# EAGLE design arduino_usb_v22 (EAGLE 5.10)
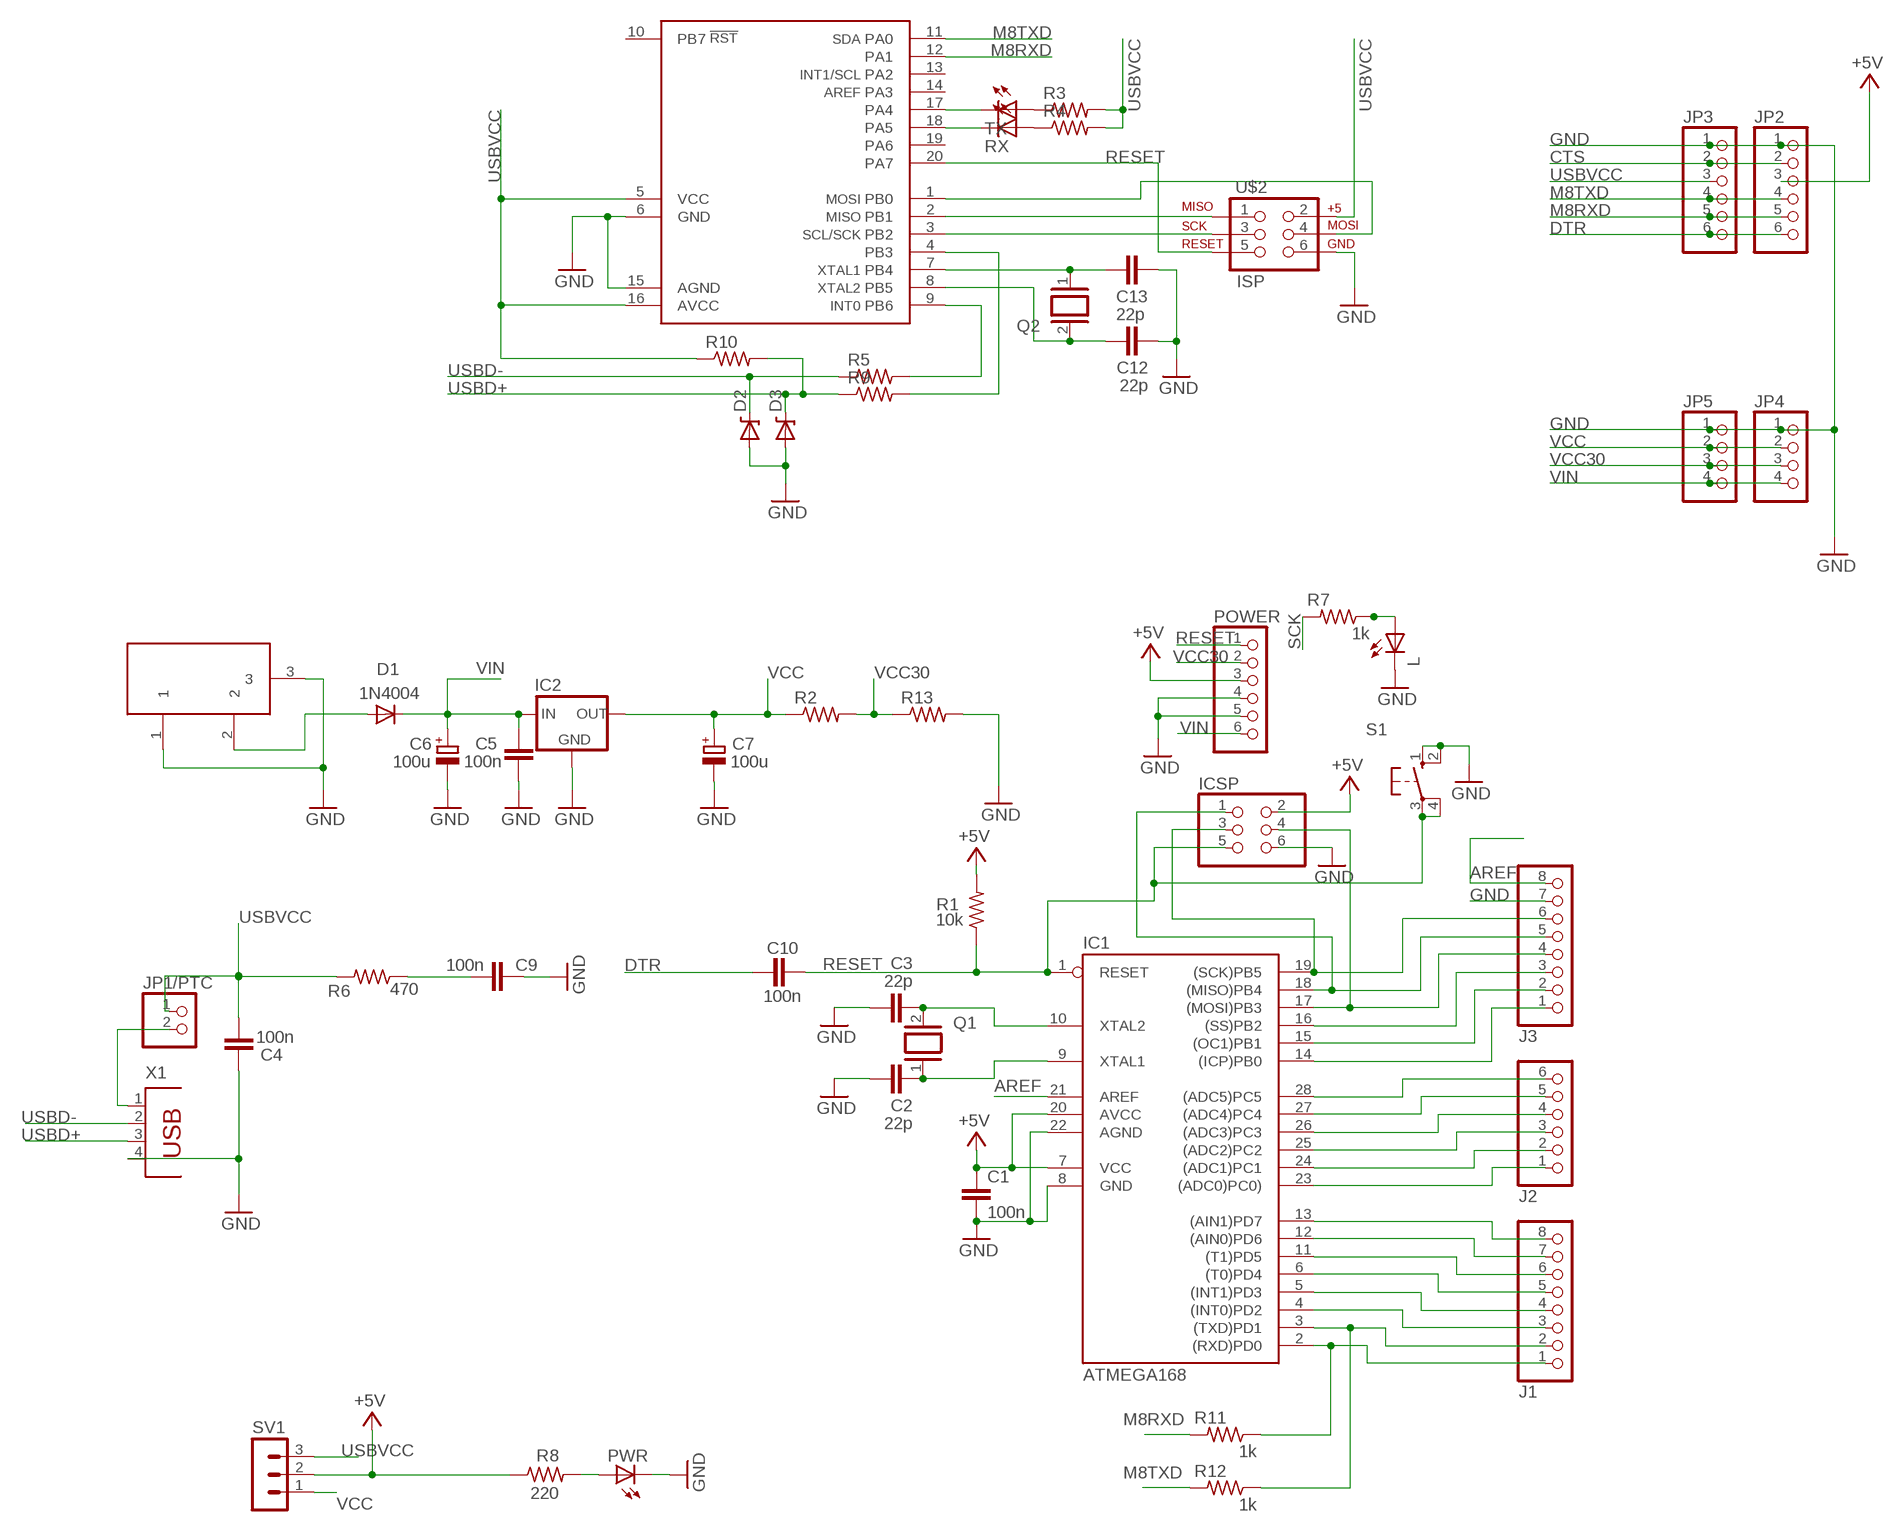
[diagram p0: schematic, sheet 1]

## Parts
C1  100n  C-EU050-025X075  [C050-025X075]
C2  22p  C-EU050-025X075  [C050-025X075]
C3  22p  C-EU050-025X075  [C050-025X075]
C4  100n  C-EU050-025X075  [C050-025X075]
C5  100n  C-EU050-025X075  [C050-025X075]
C6  100u  CPOL-EUE3.5-8  [E3,5-8]
C7  100u  CPOL-EUE3.5-8  [E3,5-8]
C9  100n  C-EU050-025X075  [C050-025X075]
C10  100n  C-EU050-025X075  [C050-025X075]
C12  22p  C-EU050-025X075  [C050-025X075]
C13  22p  C-EU050-025X075  [C050-025X075]
D1  1N4004  [DO41-10]
D2  DIODE-ZENERSMB  [SMB-DIODE]
D3  DIODE-ZENERSMB  [SMB-DIODE]
DC1  DC21MMX  [DC-21MM]
IC1  ATMEGA168  AT90S4433P  [DIL28-3]
IC2  78MXXS  [78MXXS]
ICSP  PINHD-2X3  [2X03]
J1  PINHD-1X8  [1X08]
J2  PINHD-1X6  [1X06]
J3  PINHD-1X8  [1X08]
JP1/PTC  PINHD-1X2  [1X02]
JP2  PINHD-1X6  [1X06]
JP3  PINHD-1X6  [1X06]
JP4  PINHD-1X4  [1X04]
JP5  PINHD-1X4  [1X04]
L  LED3MM  [LED3MM]
POWER  PINHD-1X6  [1X06]
PWR  LED3MM  [LED3MM]
Q1  XTAL/S  [QS]
Q2  XTAL/S  [QS]
R1  10k  R-US_0207/10  [0207/10]
R2  R-US_0207/10  [0207/10]
R3  R-US_0207/10  [0207/10]
R4  R-US_0207/10  [0207/10]
R5  R-US_0207/10  [0207/10]
R6  470  R-US_0207/10  [0207/10]
R7  1k  R-US_0207/10  [0207/10]
R8  220  R-US_0207/10  [0207/10]
R9  R-US_0207/10  [0207/10]
R10  R-US_0207/10  [0207/10]
R11  1k  R-US_0207/10  [0207/10]
R12  1k  R-US_0207/10  [0207/10]
R13  R-US_0207/10  [0207/10]
RX  LED3MM  [LED3MM]
S1  10-XX  [B3F-10XX]
SV1  MA03-1  [MA03-1]
TX  LED3MM  [LED3MM]
U$1  ATTINY61-PDIP  [DIL20]
U$2  ISP  AVR_SPI_PRG_6NS  [2X3-NS]
X1  PN61729  [PN61729]

## Nets
+5V [power]: C1.1 IC1.7(VCC) IC1.20(AVCC) ICSP.2 JP2.3 POWER.3 R1.2 R8.1 SV1.2
AREF: IC1.21(AREF) J3.8
CTS: JP2.2 JP3.2
DTR: C10.1 JP2.6 JP3.6
GND [power]: C1.2 C2.1 C3.1 C4.2 C5.1 C6.- C7.- C9.2 C12.2 C13.1 D2.A D3.A DC1.1 DC1.3 IC1.8(GND) IC1.22(AGND) IC2.GND ICSP.6 J3.7 JP2.1 JP3.1 JP4.1 JP5.1 L.K(C) POWER.4 POWER.5 PWR.K(C) R13.2 S1.1(S) S1.2(S1) U$1.6(GND) U$1.15(AGND) U$2.6 X1.4
M8RXD: JP2.5 JP3.5 R11.2 U$1.12(PA1)
M8TXD: JP2.4 JP3.4 R12.2 U$1.11(PA0)
N$1: IC1.18((MISO)PB4) ICSP.1 J3.5
N$2: L.A R7.1
N$3: PWR.A R8.2
N$4: IC1.17((MOSI)PB3) ICSP.4 J3.4
N$5: IC1.14((ICP)PB0) J3.1
N$6: C2.2 IC1.9(XTAL1) Q1.1
N$7: C3.2 IC1.10(XTAL2) Q1.2
N$8 [power]: D1.A DC1.2
N$10: IC1.4((INT0)PD2) J1.3
N$11: IC1.5((INT1)PD3) J1.4
N$12: IC1.6((T0)PD4) J1.5
N$13: IC1.11((T1)PD5) J1.6
N$14: IC1.12((AIN0)PD6) J1.7
N$15: IC1.13((AIN1)PD7) J1.8
N$16: IC1.23((ADC0)PC0)) J2.1
N$17: IC1.24((ADC1)PC1) J2.2
N$18: IC1.25((ADC2)PC2) J2.3
N$19: IC1.26((ADC3)PC3) J2.4
N$20: IC1.27((ADC4)PC4) J2.5
N$21: IC1.28((ADC5)PC5) J2.6
N$22: IC1.15((OC1)PB1) J3.2
N$23: IC1.16((SS)PB2) J3.3
N$25: R3.1 TX.A
N$26: R4.1 RX.A
N$30: C9.1 R6.1
N$34 [power]: JP1/PTC.2 X1.1
N$40: C12.1 Q2.2 U$1.8(PB5)
N$41: C13.2 Q2.1 U$1.7(PB4)
N$43: U$1.1(PB0) U$2.4
N$46: U$1.2(PB1) U$2.1
N$47: U$1.3(PB2) U$2.3
N$53: TX.K(C) U$1.17(PA4)
N$54: RX.K(C) U$1.18(PA5)
N$59: R5.2 U$1.9(PB6)
N$60: R9.2 U$1.4(PB3)
RESET: C10.2 IC1.1(RESET) ICSP.5 POWER.1 R1.1 S1.3(P) S1.4(P1) U$1.20(PA7) U$2.5
RXD: IC1.2((RXD)PD0) J1.1 R11.1
SCK: IC1.19((SCK)PB5) ICSP.3 J3.6 R7.2
TXD: IC1.3((TXD)PD1) J1.2 R12.1
USBD+: D3.C R9.1 R10.2 X1.3
USBD-: D2.C R5.1 X1.2
USBVCC [power]: C4.1 JP1/PTC.1 JP3.3 R3.2 R4.2 R6.2 R10.1 SV1.3 U$1.5(VCC) U$1.16(AVCC) U$2.2
VCC [power]: C7.+ IC2.OUT JP4.2 JP5.2 R2.1 SV1.1
VCC30: JP4.3 JP5.3 POWER.2 R2.2 R13.1
VIN [power]: C5.2 C6.+ D1.C IC2.IN JP4.4 JP5.4 POWER.6
Unconnected: U$1.10(PB7) U$1.13(PA2) U$1.14(PA3) U$1.19(PA6)

## Library data of the parts
C1-C5 C9 C10 C12 C13 = rcl:C-EU: CAPACITOR, European symbol
C6 C7 = rcl:CPOL-EU: POLARIZED CAPACITOR, European symbol
D1 = diode:1N4004: DIODE general purpose rectifier, 1 A
D2 D3 = SparkFun:DIODE-ZENER
DC1 = powersupply:DC21MM
IC1 = atmel:AT90S4433: MICROCONTROLLER 4 Kbytes FLASH 128 bytes SRAM 256 bytes EEPROM UART 6-channel 10 bit ADC
IC2 = v-reg:78MXXS: VOLTAGE REGULATOR
ICSP = pinhead:PINHD-2X3: PIN HEADER
J1 J3 = pinhead:PINHD-1X8: PIN HEADER
J2 JP2 JP3 POWER = pinhead:PINHD-1X6: PIN HEADER
JP1/PTC = pinhead:PINHD-1X2: PIN HEADER
JP4 JP5 = pinhead:PINHD-1X4: PIN HEADER
L PWR RX TX = led:LED: LED OSRAM: - CHIPLED LG R971, LG N971, LY N971, LG Q971, LY Q971, LO R971, LY R971 LH N974, LH R974 LS Q976, LO Q976, LY Q976 LO Q996 - Hyper CHIPLED LW Q18S LB Q993, LB Q99A, LB R99A - SideLED LS A670, LO A670, LY A670, LG A670, LP A670 LB A673, LV A673, LT A673, LW A673 LH A674 LY A675 LS A676, LA A676, LO A676, LY A676, LW A676 LS A679, LY A679, LG A679 - Hyper Micro SIDELED® LS Y876, LA Y876, LO Y876, LY Y876 LT Y87S - SmartLED LW L88C, LW L88S LB L89C, LB L89S, LG L890 LS L89K, LO L89K, LY L89K LS L896, LA L896, LO L896, LY L896 - TOPLED LS T670, LO T670, LY T670, LG T670, LP T670 LSG T670, LSP T670, LSY T670, LOP T670, LYG T670 LG T671, LOG T671, LSG T671 LB T673, LV T673, LT T673, LW T673 LH T674 LS T676, LA T676, LO T676, LY T676, LB T676, LH T676, LSB T676, LW T676 LB T67C, LV T67C, LT T67C, LS T67K, LO T67K, LY T67K, LW E67C LS E67B, LA E67B, LO E67B, LY E67B, LB E67C, LV E67C, LT E67C LW T67C LS T679, LY T679, LG T679 LS T770, LO T770, LY T770, LG T770, LP T770 LB T773, LV T773, LT T773, LW T773 LH T774 LS E675, LA E675, LY E675, LS T675 LS T776, LA T776, LO T776, LY T776, LB T776 LHGB T686 LT T68C, LB T68C - Hyper Mini TOPLED® LB M676 - Mini TOPLED Santana® LG M470 LS M47K, LO M47K, LY M47K Source: http://www.osram.convergy.de/
Q1 Q2 = special:XTAL/S: CRYSTAL
R1-R13 = resistor:R-US_: RESISTOR, American symbol
S1 = switch-omron:10-XX: OMRON SWITCH
SV1 = con-lstb:MA03-1: PIN HEADER
U$1 = SparkFun:ATTINY*61-PDIP
U$2 = SparkFun:AVR_SPI_PRG_6: AVR ISP 6 Pin This is the reduced ISP connector for AVR programming. Common on Arduino. This footprint will take up less PCB space and can be used with a 10-pin to 6-pin adapter such as SKU: BOB-08508
X1 = con-berg:PN61729: BERG USB connector

## Net classes
1 power: width 0.406 mm

## Board
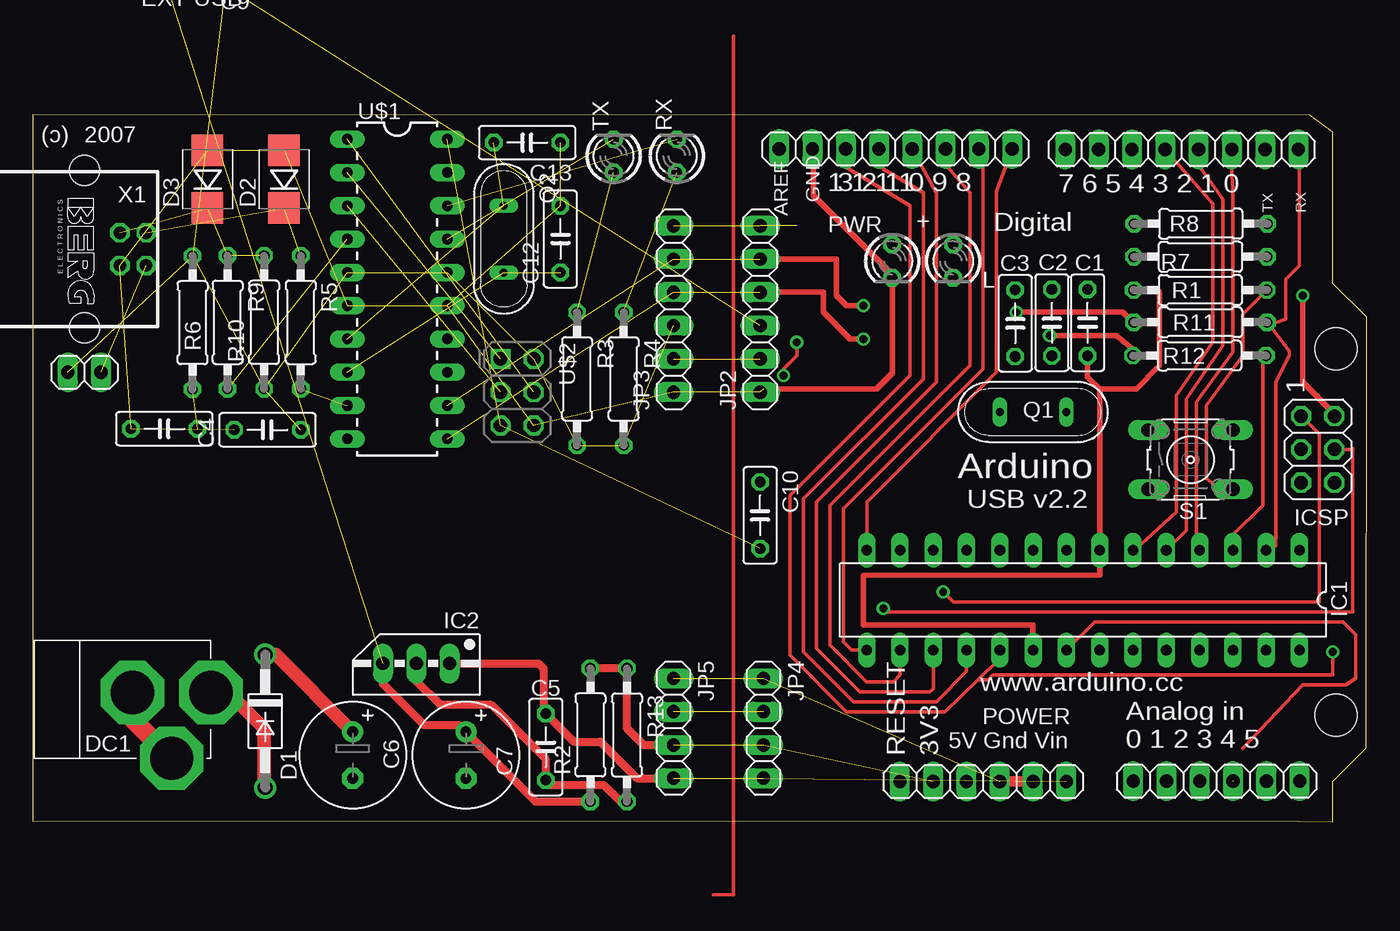
[diagram p1: board, top side]
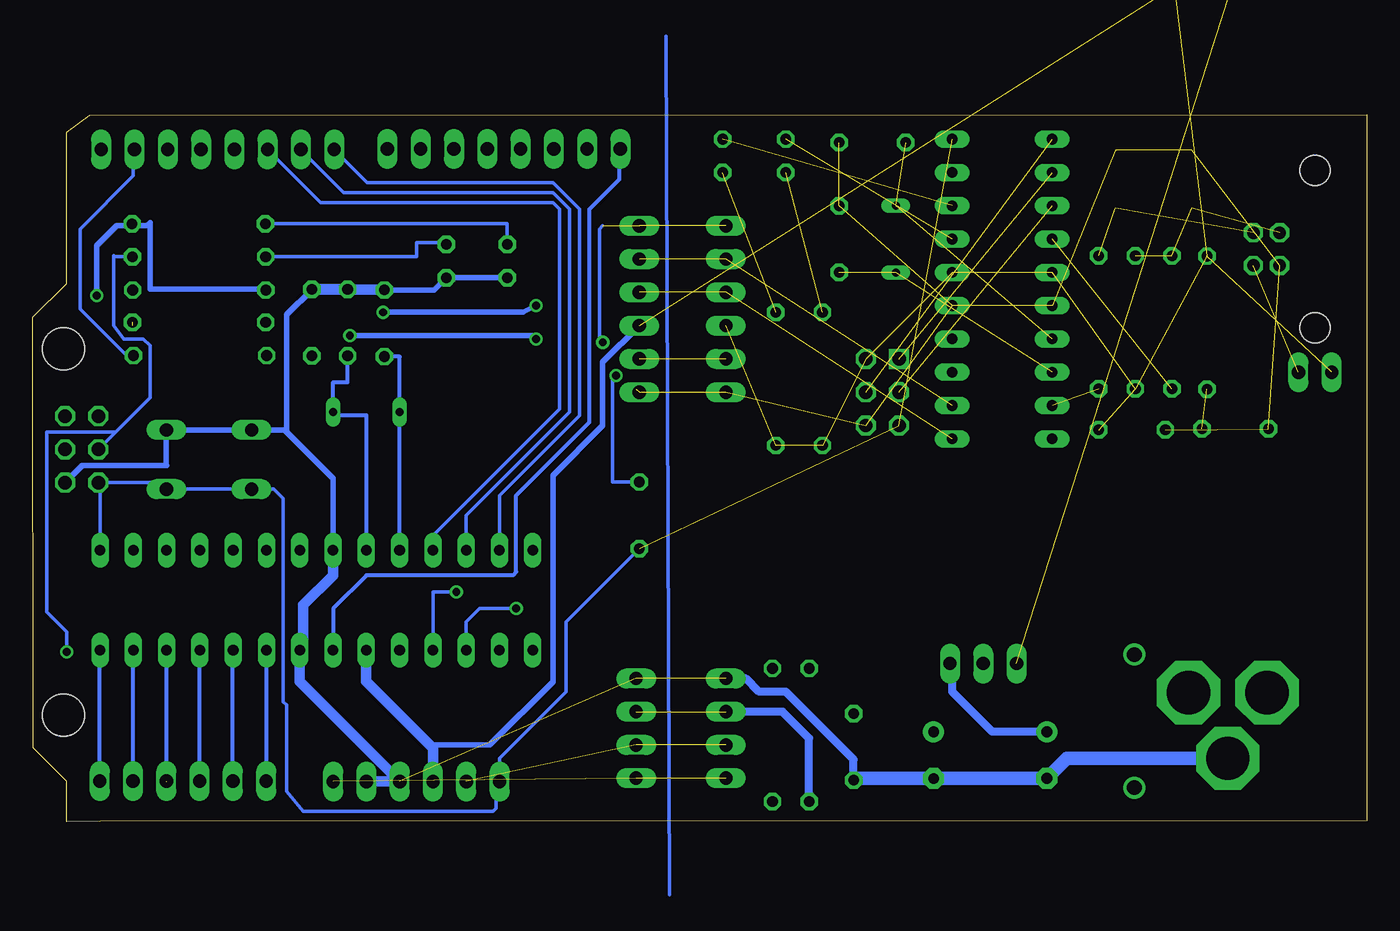
[diagram p2: board, bottom side, seen from below]

Size 101.79 x 53.95 mm. Coordinates in mm from the lower left corner, seen from the top.
Outline: 0,53.95 0,0.05 96.65,0.01 99.21,0 99.2,0.05 99.19,3.06 101.77,5.61 101.79,38.51 99.19,41.05 99.19,52.6 97.46,53.91 0,53.95
Copper layers (1*16): Top 0.035mm / dielectric 1.5mm / Bottom 0.035mm
Design rules "default *": minimum track width 10mil, minimum drill 10mil, track to track 10mil, track to pad 10mil, pad to pad 10mil, via to via 10mil, smd to smd 8mil, copper to edge 20mil, drill to drill 8mil, minimum pad ring 10mil, minimum via ring 8mil, stop-mask expansion 4mil, vias tented up to drill 0mil, thermal gap 10mil
Holes 3.2 mm at 99.44,36.08 99.44,8.14

### Footprints (pad centres in the part's own frame; a part is rotated, then mirrored left to right if it is on the bottom)
C050-025X075 = drill 0.813 octagon: 1 -2.54,0; 2 2.54,0
E3,5-8 = drill 0.813 pad 1.6 round: + -1.778,0 | drill 0.813 pad 1.6 octagon: - 1.778,0
DO41-10 = drill 1.118 round: A 5.08,0; C -5.08,0
SMB-DIODE = smd 2.4 x 2.4: A 2.2,0; C -2.2,0
DC-21MM = drill 3.302 pad 4.826 octagon: 1 -5.08,-3.353; 2 -0.076,-6.35; 3 -0.076,-0.356
DIL28-3 = drill 0.813 long: 1 -16.51,-3.81; 2 -13.97,-3.81; 3 -11.43,-3.81; 4 -8.89,-3.81; 5 -6.35,-3.81; 6 -3.81,-3.81; 7 -1.27,-3.81; 8 1.27,-3.81; 9 3.81,-3.81; 10 6.35,-3.81; 11 8.89,-3.81; 12 11.43,-3.81; 13 13.97,-3.81; 14 16.51,-3.81; 15 16.51,3.81; 16 13.97,3.81; 17 11.43,3.81; 18 8.89,3.81; 19 6.35,3.81; 20 3.81,3.81; 21 1.27,3.81; 22 -1.27,3.81; 23 -3.81,3.81; 24 -6.35,3.81; 25 -8.89,3.81; 26 -11.43,3.81; 27 -13.97,3.81; 28 -16.51,3.81
78MXXS = drill 1.016 long: GND 0,-2.54; IN -2.54,-2.54; OUT 2.54,-2.54
2X03 = drill 1.016 octagon: 1 -2.54,-1.27; 2 -2.54,1.27; 3 0,-1.27; 4 0,1.27; 5 2.54,-1.27; 6 2.54,1.27
1X08 = drill 1.016 long: 1 -8.89,0; 2 -6.35,0; 3 -3.81,0; 4 -1.27,0; 5 1.27,0; 6 3.81,0; 7 6.35,0; 8 8.89,0
1X06 = drill 1.016 long: 1 -6.35,0; 2 -3.81,0; 3 -1.27,0; 4 1.27,0; 5 3.81,0; 6 6.35,0
1X02 = drill 1.016 long: 1 -1.27,0; 2 1.27,0
1X04 = drill 1.016 long: 1 -3.81,0; 2 -1.27,0; 3 1.27,0; 4 3.81,0
LED3MM = drill 0.813 octagon: A -1.27,0; K 1.27,0
QS = drill 0.61 long: 1 -2.54,0; 2 2.54,0
0207/10 = drill 0.813 octagon: 1 -5.08,0; 2 5.08,0
B3F-10XX = drill 1.016 long: 1 -3.251,2.261; 2 3.251,2.261; 3 -3.251,-2.261; 4 3.251,-2.261
MA03-1 = drill 1.016 long: 1 -2.54,0; 2 0,0; 3 2.54,0
DIL20 = drill 0.813 long: 1 1.27,-7.62; 2 3.81,-7.62; 3 6.35,-7.62; 4 8.89,-7.62; 5 11.43,-7.62; 6 13.97,-7.62; 7 16.51,-7.62; 8 19.05,-7.62; 9 21.59,-7.62; 10 24.13,-7.62; 11 24.13,0; 12 21.59,0; 13 19.05,0; 14 16.51,0; 15 13.97,0; 16 11.43,0; 17 8.89,0; 18 6.35,0; 19 3.81,0; 20 1.27,0
2X3-NS = drill 1.016 square: 1 -2.54,-1.27 | drill 1.016 octagon: 2 -2.54,1.27; 3 0,-1.27; 4 0,1.27; 5 2.54,-1.27; 6 2.54,1.27
PN61729 = drill 0.95 octagon: 1 1.25,4.71; 2 -1.25,4.71; 3 -1.25,2.71; 4 1.25,2.71 | hole 2.3: -6.02,0; 6.02,0

### Placement (x,y rotation side)
C1  80.49,38.08 90 top
C2  77.77,38.09 270 top
C3  74.97,38.04 270 top
C4  17.91,29.91 180 top
C5  39.16,5.7 90 top
C6  24.41,5.08 270 top
C7  33.05,5.07 270 top
C9  10.04,29.98 180 top
C10  55.5,23.38 270 top
C12  40.26,44.46 90 top
C13  37.72,51.83 180 top
D1  17.73,7.67 270 top
D2  19.18,49.03 90 top
D3  13.34,49.03 90 top
DC1  7.24,9.92 90 top
IC1  80.15,16.91 180 top
IC2  29.26,9.54 180 top
ICSP  98.06,28.41 270 top
J1  87.69,51.3 180 top
J2  90.33,3.09 0 top
J3  65.84,51.34 180 top
JP1/PTC  3.94,34.3 0 top
JP2  55.5,39.13 90 top
JP3  48.9,39.13 90 top
JP4  55.76,7.12 270 top
JP5  48.9,7.12 270 top
L  70.23,42.78 270 top
POWER  72.52,3.06 0 top
PWR  65.59,42.78 270 top
Q1  76.33,31.26 180 top
Q2  35.94,44.46 270 top
R1  89.09,40.57 180 top
R2  42.55,6.61 90 top
R3  41.53,33.79 270 top
R4  45.09,33.79 270 top
R5  20.45,38.11 270 top
R6  12.2,38.09 90 top
R7  89.11,43.11 0 top
R8  89.13,45.63 180 top
R9  14.86,38.11 270 top
R10  17.66,38.11 90 top
R11  89.11,38.11 180 top
R12  89.03,35.57 180 top
R13  45.34,6.61 270 top
RX  49.15,50.81 90 top
S1  88.34,27.63 0 top
SV1  12.32,65.29 0 top  (outside the outline)
TX  44.33,50.81 90 top
U$1  31.63,53.35 270 top
U$2  36.96,32.78 270 top
X1  3.94,43.7 270 top

### Tracks (layer width: path | path; a pad name or v marks a point on that pad's centre or on a via)
+5V  (via drill 0.6)  (1 unrouted)
  Top 0.406: IC1.20 76.33,15 63.38,15 63.38,18.81 81.42,18.82 IC1.7 81.41,33.03 | 81.41,33.03 80.49,33.95 C1.1 | R1.2 84.01,40.46 84.2,40.65 85.73,40.65 85.98,40.4 85.98,34.81 84.2,33.03 81.41,33.03 | v96.9,40.14 96.9,33.54 99.33,31.11 ICSP.2
  Bottom 0.406: 94.36,45.48 R8.1 | 94.36,45.48 95.38,45.48 96.9,43.95 v96.9,40.14 | R1.2 84.09,40.65 92.84,40.65 92.84,45.73 93.09,45.48 94.36,45.48 | JP2.3 58.3,35.06 58.3,30.24 62.11,26.43 62.11,10.68 66.93,5.85 71.5,5.85
  Bottom 0.813: POWER.3 71.25,5.6 71.5,5.85 76.34,10.69 IC1.20
AREF
  Top 0.254: 92.33,5.6 96.9,10.42 100.21,10.42 100.97,10.93 100.97,14.23 99.95,15.25 81.03,15.25 IC1.21
  Bottom 0.305: IC1.21 78.87,16.27 76.33,18.81 65.15,18.81 64.9,19.06 64.9,24.9 59.31,30.49 59.31,46.75 57.03,49.03 57.03,51.27 J3.8
CTS  (1 unrouted)
DTR  (via drill 0.6)  (2 unrouted)
  Top 0.254: v57.28,34.05 57.28,34.55 58.3,35.57 v58.3,36.59
  Bottom 0.254: v57.28,34.05 57.53,33.79 57.53,25.92 C10.1 | v58.3,36.59 58.55,36.84 58.55,45.22 58.3,45.48
GND  (14 unrouted)
  Top 0.406: J3.7 59.57,51.27 59.57,47.76 65.59,41.74 PWR.K 65.59,34.22 64.39,33.03 55.76,33.03
  Top 0.61: R13.2 44.83,1.53 43.56,2.8 39.51,2.8 C5.1 39.16,4.75 35,8.9 31.12,8.9 29.26,10.75 IC2.GND
  Top 0.813: POWER.4 POWER.5
  Top 1.422: DC1.3 7.6,7.83 DC1.1
  Bottom 0.406: PWR.K L.K 71.17,40.57 C3.1 75.02,40.62 | C1.2 82.43,38.69 82.43,29.73 | 82.43,29.73 82.59,29.89 S1.1 S1.2 91.6,27.21 91.57,27.19 98.01,27.19 ICSP.6 | 82.43,29.73 78.88,26.18 IC1.8 | IC1.22 81.16,13.36
  Bottom 0.61: C7.- | 39.02,3.29 C5.1 39.16,4.75 44.33,9.92 46.36,9.92 47.37,10.93 JP5.1
  Bottom 0.813: C1.2 75.02,40.62 | C1.2 C2.1 | POWER.5 POWER.4 81.42,10.69 IC1.22 | 81.16,13.36 81.16,16.52 78.88,18.8 IC1.8
  Bottom 1.016: DC1.1 22.87,4.84 C6.- C7.- | C7.- 39.02,3.29
M8RXD  (via drill 0.6)  (2 unrouted)
  Top 0.406: v63.38,39.38 62.11,39.38 61.34,40.14 61.34,42.94 JP2.5 | v75.06,38.87 83.19,38.87 83.95,38.11 R11.2
  Bottom 0.406: v63.38,39.38 64.39,38.87 v75.06,38.87
M8TXD  (via drill 0.6)  (2 unrouted)
  Top 0.406: JP2.4 60.33,40.4 60.33,38.87 62.36,36.84 v63.38,36.84 | v77.6,37.09 82.68,37.09 83.95,36.08 R12.2
  Bottom 0.406: v63.38,36.84 63.63,37.09 v77.6,37.09
N$1  (via drill 0.6)
  Top 0.254: J3.5 64.65,51.27 64.65,50.05 64.9,49.79 67.95,48.02 67.95,33.79 58.8,24.65 58.8,12.96 62.61,9.15 68.96,9.15 71.26,11.45 IC1.18 | ICSP.1 98.17,29.56 98.17,16.77 70.23,16.77 v69.47,17.54
  Bottom 0.254: IC1.18 71.25,17.54 v69.47,17.54
N$2
  Bottom 0.254: R7.1 72.52,43.11 72.52,44.21 70.23,44.21 L.A
N$3
  Bottom 0.254: R8.2 65.59,45.63 PWR.A
N$4  (via drill 0.6)
  Top 0.254: J3.4 68.96,47.96 68.96,33.54 59.82,24.39 59.82,13.22 63.12,9.92 68.46,9.92 68.72,10.18 IC1.17 | v64.9,16.27 65.15,16.01 100.71,16.01 100.71,28.46 100.66,28.41 ICSP.4
  Bottom 0.254: IC1.17 68.71,15.25 67.69,16.27 v64.9,16.27
N$5
  Top 0.254: J3.1 73.54,48.11 73.54,34.3 63.64,24.41 IC1.14
N$6
  Bottom 0.305: C2.2 77.77,33.54 78.87,33.54 Q1.1 78.87,31 76.33,31 IC1.9
N$7
  Bottom 0.305: C3.2 73.79,35.49 Q1.2 73.8,31.26 IC1.10
N$8
  Top 0.61: D1.A 17.66,2.66
  Top 1.016: DC1.2 14.94,9.84 17.66,7.12 17.66,2.66
N$10
  Top 0.254: IC1.4 88.78,21.24 88.78,32.01 91.57,35.82 91.57,48.27 91.5,49.36 J1.3
N$11
  Top 0.254: IC1.5 88.01,22.23 88.01,32.27 90.81,36.33 90.81,47.51 88.96,50.12 J1.4
N$12
  Top 0.254: J1.5 90.05,47.16 90.05,36.59 87.25,32.52 87.25,23.63 84.08,20.72 IC1.6
N$13
  Bottom 0.254: J1.6 79.83,47.25 62.11,47.25 61.6,46.75 61.6,31.51 71.26,21.84 IC1.11
N$14
  Bottom 0.254: J1.7 78.06,48.02 62.11,48.02 60.84,46.75 60.84,31.25 68.72,23.37 IC1.12
N$15
  Bottom 0.254: J1.8 76.28,48.78 62.11,48.78 60.07,46.75 60.07,31 66.18,24.89 IC1.13
N$16
  Bottom 0.305: J2.1 83.96,3.09 IC1.23
N$17
  Bottom 0.305: IC1.24 86.52,13.1 J2.2
N$18
  Bottom 0.305: J2.3 89.04,3.09 IC1.25
N$19  (1 unrouted)
  Bottom 0.305: IC1.26 91.57,3.06
N$20
  Bottom 0.305: J2.5 94.12,3.09 IC1.27
N$21
  Bottom 0.305: IC1.28 96.68,13.1 J2.6
N$22
  Top 0.254: J3.2 72.52,51.27 72.52,34.55 61.85,23.89 61.85,13.73 62.48,13.1 IC1.15
N$23
  Top 0.254: J3.3 69.73,51.27 69.73,50.05 71.5,48.02 71.5,34.81 60.84,24.14 60.84,13.47 63.63,10.68 65.66,10.68 66.18,11.2 IC1.16
N$24
  Top 0.254: 53.47,59.95 53.47,-5.58 51.95,-5.58
N$25  (1 unrouted)
N$26  (1 unrouted)
N$27
  Bottom 0.254: 53.22,-5.58 53.47,59.95
N$30  (1 unrouted)
N$34  (1 unrouted)
N$40  (2 unrouted)
N$41  (2 unrouted)
N$43  (1 unrouted)
N$46  (1 unrouted)
N$47  (1 unrouted)
N$53  (1 unrouted)
N$54  (1 unrouted)
N$59  (1 unrouted)
N$60  (1 unrouted)
RESET  (2 unrouted)
  Top 0.254: R1.1 92.33,38.73 92.33,35.57 89.54,31.76 89.54,26.17 90.59,25.37 S1.4
  Bottom 0.254: 96.65,25.87 96.65,20.84 | ICSP.5 91.6,25.87 S1.4 S1.3 83.4,25.37 82.68,24.65 82.68,9.15 82.43,8.9 82.43,2.3 81.16,0.77 66.68,0.77 66.42,1.03 66.42,2.8 POWER.1 66.17,4.84 61.09,9.92 61.09,15.25 C10.2
  Bottom 0.305: ICSP.5 96.65,25.87 | 96.65,20.84 96.66,20.84 IC1.1
RXD  (1 unrouted)
  Top 0.254: J1.1 96.65,51.3 96.65,42.43 95.63,41.41 95.63,38.36 94.19,37.86 | R11.1 95.89,35.9 95.89,35.57 94.87,33.54 94.87,21.09 94.5,20.72 IC1.2
SCK  (via drill 0.6)
  Top 0.254: 72.11,10.82 69.6,8.39 62.11,8.39 57.79,12.71 57.79,24.9 66.93,34.05 66.93,47 63.12,49.29 61.78,50.12 J3.6 | 72.11,10.82 73.79,12.46 73.8,12.47 IC1.19 | v99.19,12.96 99.19,11.19 73.28,11.19 72.92,10.82 72.11,10.82
  Bottom 0.254: 95.47,29.73 ICSP.3 | R7.2 95.56,43.11 95.63,43.19 95.63,37.86 94.87,36.84 93.35,36.84 92.84,36.33 92.84,32.36 95.47,29.73 | 95.47,29.73 100.71,29.73 100.71,16.01 99.19,14.49 v99.19,12.96
TXD
  Top 0.254: R12.1 93.86,35.32 93.86,24.14 91.58,21.87 IC1.3
  Bottom 0.254: J1.2 94.11,51.3 94.11,49.29 98.17,45.22 98.17,39.13 94.62,35.57 R12.1
USBD+  (3 unrouted)
USBD-  (2 unrouted)
USBVCC  (10 unrouted)
VCC  (2 unrouted)
  Top 0.61: R2.1 38.37,1.53 C7.+ 32.52,7.38 29.85,7.38 26.72,10.5 IC2.OUT
  Bottom 0.61: R2.1 42.55,6.36 44.58,8.39 JP5.2
VCC30  (2 unrouted)
  Top 0.61: R2.2 R13.1 45.34,7.12 46.61,5.85 JP5.3
VIN  (2 unrouted)
  Top 0.61: IC2.IN 38.61,12.08 38.99,11.69 38.99,8.4 C5.2 41.29,6.11 43.31,6.11 46.1,3.31 JP5.4
  Top 1.016: D1.C 18.52,12.75 C6.+
  Bottom 0.61: C6.+ 28.56,6.86 31.63,9.92 31.63,11.9 IC2.IN

### Text on the board
tNames: PWR | SEL | EXT USB | (c) | 2007 | 1 1 1 1 | 3 2 1 0 9 8 | GND | 7 6 5 4 3 2 1 0 | AREF | TX | RX | + | Digital | 1 | Arduino | USB v2.2 | www.arduino.cc | Analog in | RESET | 3V3 | 5V Gnd Vin | 0 1 2 3 4 5